# EAGLE design YOTSUBA_AP_EM_ver.4.0 (EAGLE 9.6.2)
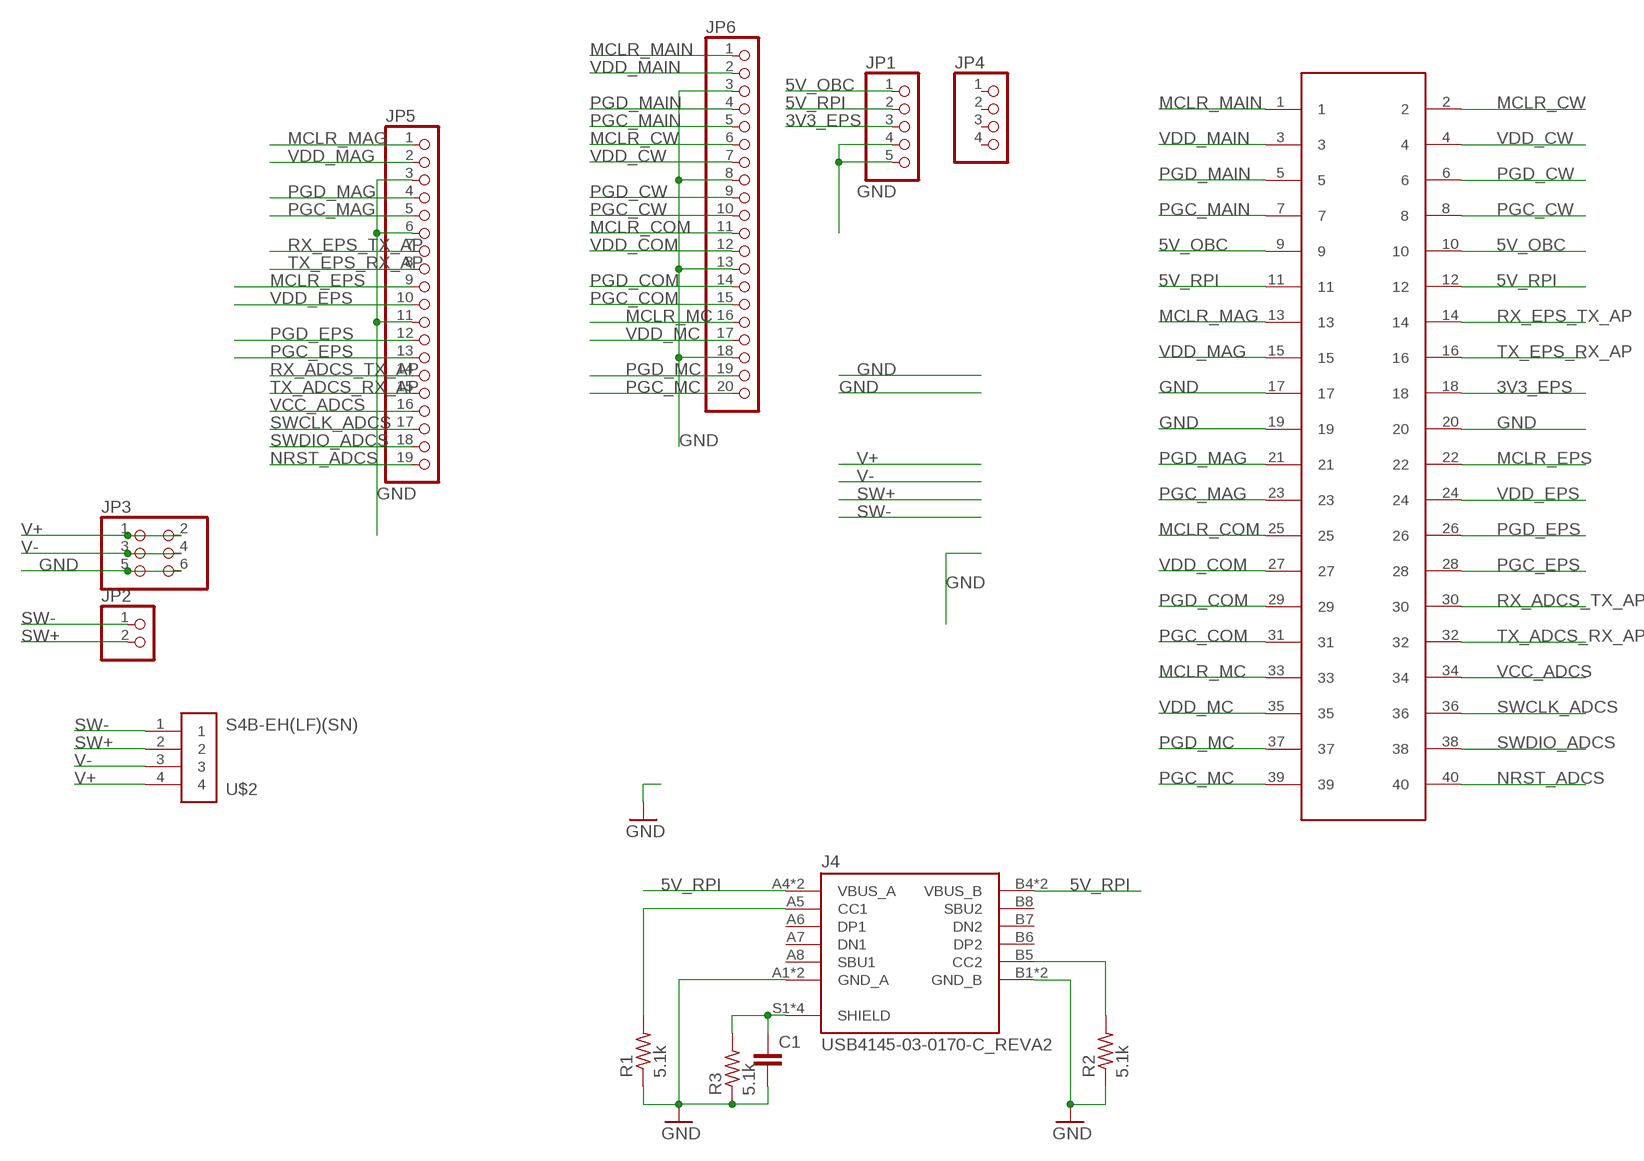
[diagram p0: schematic, sheet 1]

## Parts
C1  C-EUC2012  [C2012]
J4  USB4145-03-0170-C_REVA2  [GCT_USB4145-03-0170-C_REVA2]
JP1  PINHD-1X5  [1X05]
JP2  PINHD-1X2  [1X02]
JP3  PINHD-2X3  [2X03]
JP4  PINHD-1X4  [1X04]
JP5  PINHD-1X19  [1X19]
JP6  PINHD-1X20  [1X20]
R1  5.1k  R-US_R0805  [R0805]
R2  5.1k  R-US_R0805  [R0805]
R3  5.1k  R-US_R0805  [R0805]
U$1  M50-3902042  [M50-3902042]
U$2  S4B-EH(LF)(SN)  [JST_S4B-EH(LF)(SN)]

## Nets
3V3_EPS: JP1.3 U$1.18
5V_OBC: JP1.1 U$1.9 U$1.10
5V_RPI: J4.A4(VBUS_A) J4.A9(VBUS_A) J4.B4(VBUS_B) J4.B9(VBUS_B) JP1.2 U$1.11 U$1.12
GND [gnd]: C1.2 J4.A1(GND_A) J4.A12(GND_A) J4.B1(GND_B) J4.B12(GND_B) JP1.4 JP1.5 JP3.5 JP3.6 JP5.3 JP5.6 JP5.11 JP6.3 JP6.8 JP6.13 JP6.18 R1.1 R2.1 R3.1 U$1.17 U$1.19 U$1.20
MCLR_COM: JP6.11 U$1.25
MCLR_CW: JP6.6 U$1.2
MCLR_EPS: JP5.9 U$1.22
MCLR_MAG: JP5.1 U$1.13
MCLR_MAIN: JP6.1 U$1.1
MCLR_MC: JP6.16 U$1.33
N$1: C1.1 J4.S1(SHIELD) J4.S2(SHIELD) J4.S3(SHIELD) J4.S4(SHIELD) R3.2
N$2: J4.A5(CC1) R1.2
N$3: J4.B5(CC2) R2.2
NRST_ADCS [gnd]: JP5.19 U$1.40
PGC_COM: JP6.15 U$1.31
PGC_CW: JP6.10 U$1.8
PGC_EPS: JP5.13 U$1.28
PGC_MAG: JP5.5 U$1.23
PGC_MAIN: JP6.5 U$1.7
PGC_MC: JP6.20 U$1.39
PGD_COM: JP6.14 U$1.29
PGD_CW: JP6.9 U$1.6
PGD_EPS: JP5.12 U$1.26
PGD_MAG: JP5.4 U$1.21
PGD_MAIN: JP6.4 U$1.5
PGD_MC: JP6.19 U$1.37
RX_ADCS_TX_AP: JP5.14 U$1.30
RX_EPS_TX_AP: JP5.7 U$1.14
SW+ [pwr]: JP2.2 U$2.2
SW- [pwr]: JP2.1 U$2.1
SWCLK_ADCS: JP5.17 U$1.36
SWDIO_ADCS: JP5.18 U$1.38
TX_ADCS_RX_AP: JP5.15 U$1.32
TX_EPS_RX_AP: JP5.8 U$1.16
V+ [pwr]: JP3.1 JP3.2 U$2.4
V- [pwr]: JP3.3 JP3.4 U$2.3
VCC_ADCS: JP5.16 U$1.34
VDD_COM: JP6.12 U$1.27
VDD_CW: JP6.7 U$1.4
VDD_EPS: JP5.10 U$1.24
VDD_MAG: JP5.2 U$1.15
VDD_MAIN: JP6.2 U$1.3
VDD_MC: JP6.17 U$1.35
Unconnected: J4.A6(DP1) J4.A7(DN1) J4.A8(SBU1) J4.B6(DP2) J4.B7(DN2) J4.B8(SBU2) JP4.1 JP4.2 JP4.3 JP4.4

## Library data of the parts
C1 = rcl:C-EU: CAPACITOR, European symbol; SPICEPREFIX: C
J4 = USB4145-03-0170-C_REVA2:USB4145-03-0170-C_REVA2: Check availability <https://pricing.snapeda.com/parts/USB4145-03-0170-C/Global%20Connector%20Technology/view-part?ref=eda>; AVAILABILITY: In Stock; DESCRIPTION: Type C USB 2.0 Connector; MF: Global Connector Technology; MP: USB4145-03-0170-C; PACKAGE: None; PRICE: None
JP1 = pinhead:PINHD-1X5: PIN HEADER
JP2 = pinhead:PINHD-1X2: PIN HEADER
JP3 = pinhead:PINHD-2X3: PIN HEADER
JP4 = pinhead:PINHD-1X4: PIN HEADER
JP5 = pinhead:PINHD-1X19: PIN HEADER
JP6 = pinhead:PINHD-1X20: PIN HEADER
R1-R3 = rcl:R-US_: RESISTOR, American symbol; SPICEPREFIX: R
U$1 = MITSUBA_Connectors-v4.0:M50-3902042: 40pins 1.27mm pitch 2line pinheader
U$2 = S4B-EH_LF__SN_:S4B-EH(LF)(SN): EH Series 4 Position 2.5 mm Side Entry Single Row Shrouded Header Check availability <https://pricing.snapeda.com/parts/S4B-EH%28LF%29%28SN%29/JST%20Sales/view-part?ref=eda>; AVAILABILITY: In Stock; DESCRIPTION: Connector Header Through Hole, Right Angle 4 position 0.098 (2.50mm); MF: JST Sales; MP: S4B-EH(LF)(SN); PACKAGE: None; PRICE: None; PURCHASE-URL: https://pricing.snapeda.com/search/part/S4B-EH(LF)(SN)/?ref=eda

## Net classes
0 default: clearance 0.254 mm
1 gnd: clearance 0.559 mm
2 pwr: clearance 0.229 mm
3 gnd_usb: clearance 0.025 mm

## Board
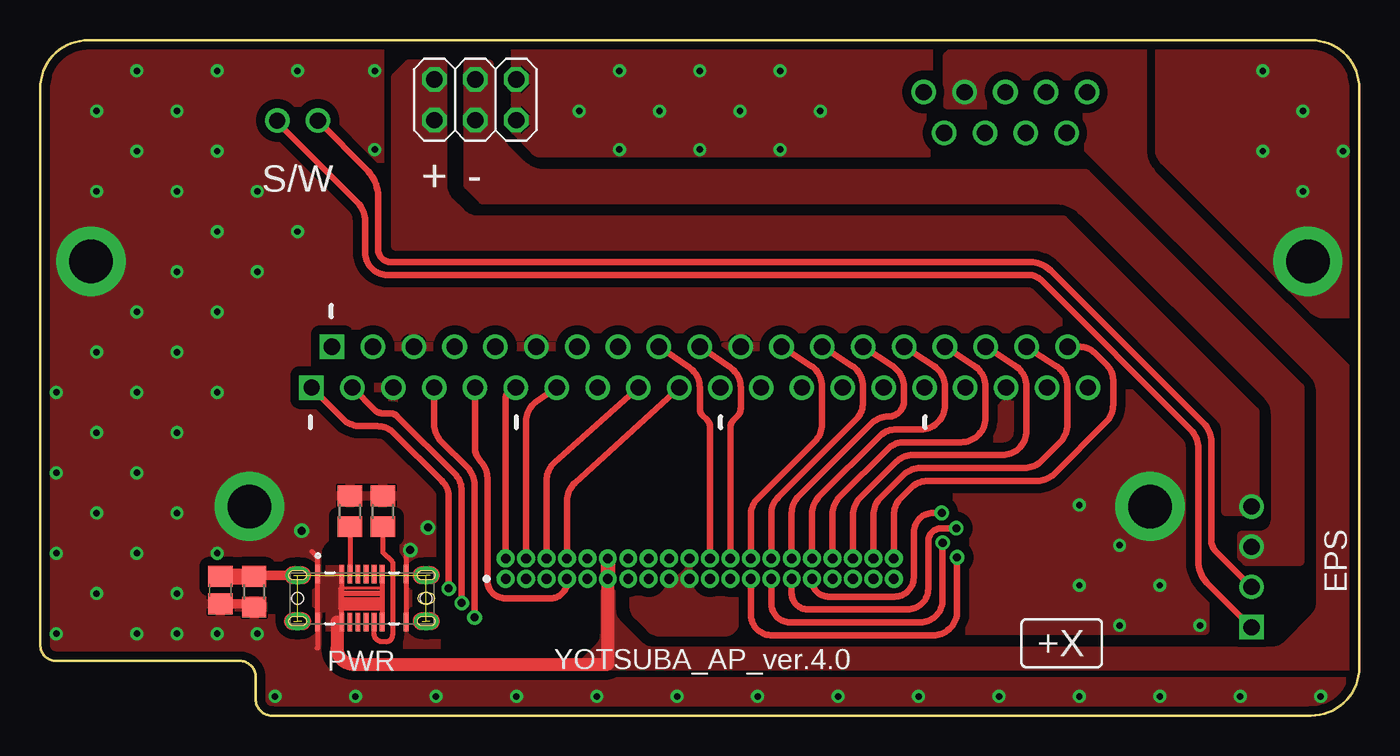
[diagram p1: board, top side]
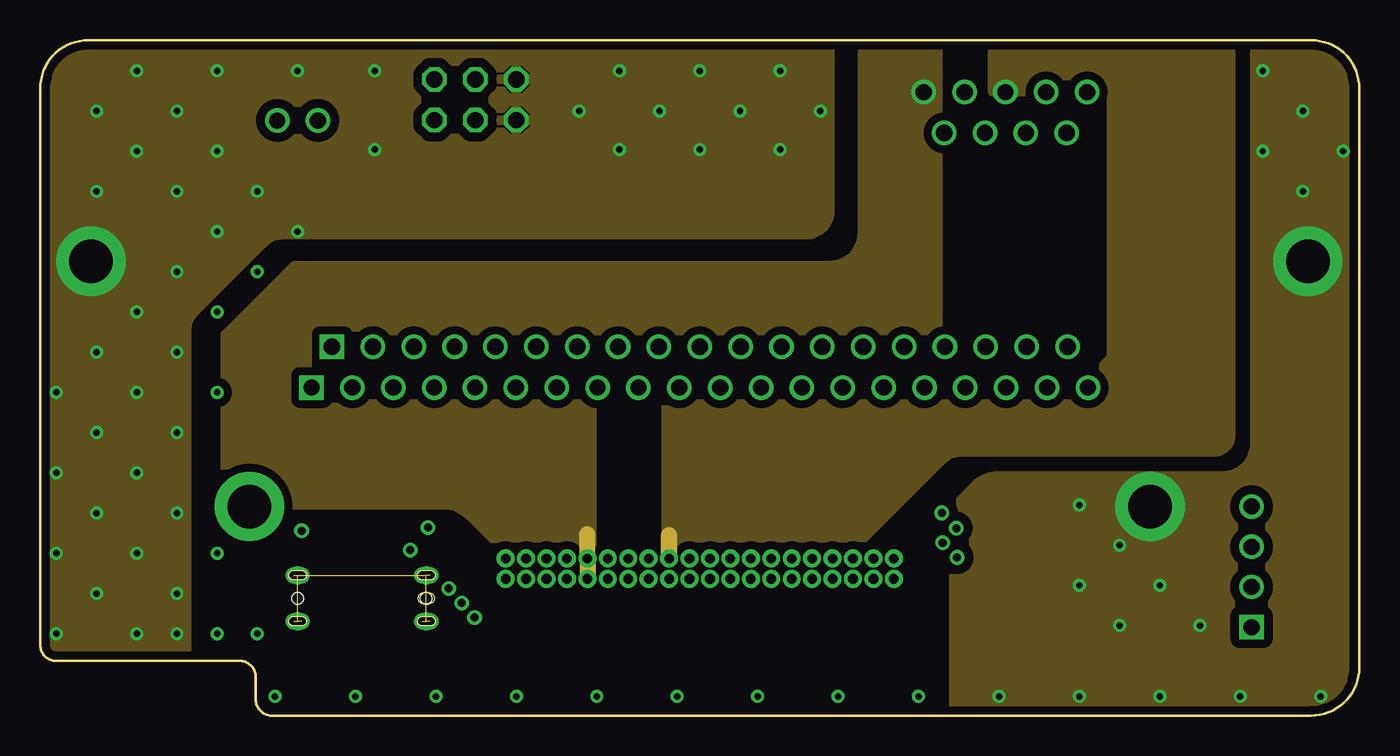
[diagram p2: board, inner layer Route2]
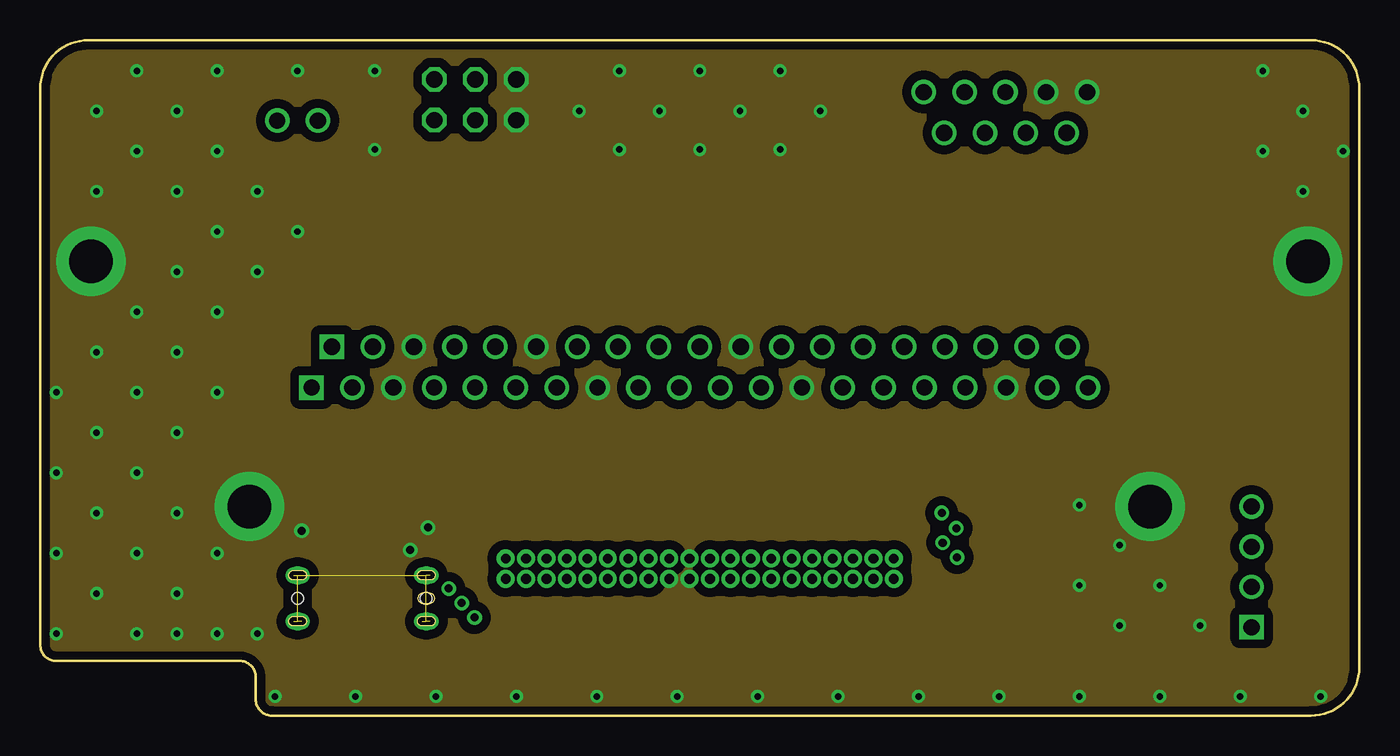
[diagram p3: board, inner layer Route15]
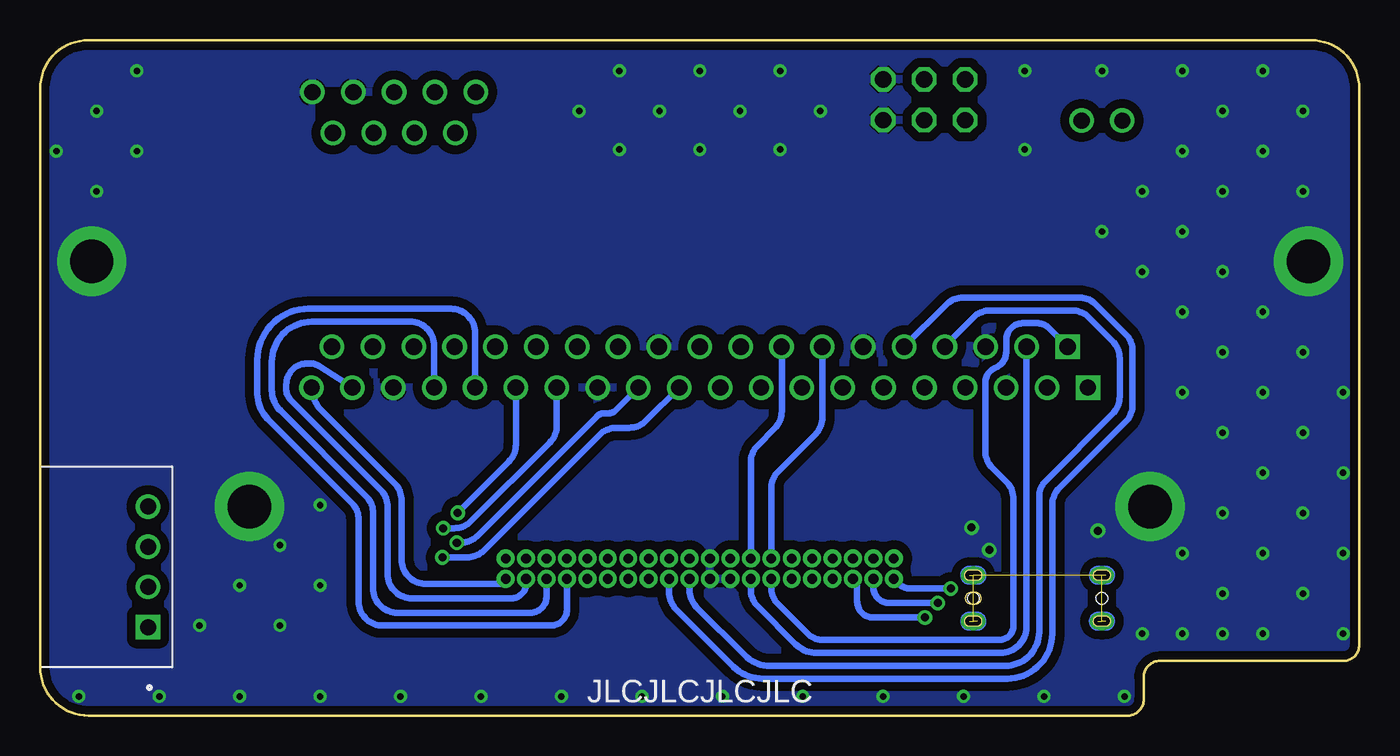
[diagram p4: board, bottom side, seen from below]

Size 82 x 42 mm. Coordinates in mm from the lower left corner, seen from the top.
Outline: 14.4,0 79,0 arc90 82,3 82,39 arc90 79,42 3,42 arc90 0,39 0,4.4 arc90 1,3.4 12.4,3.4 arc-90 13.4,2.4 13.4,1 arc90 14.4,0
Copper layers (1+2*15+16): Top 0.035mm / dielectric 1.5mm / Route2 0.035mm / dielectric 0.15mm / Route15 0.035mm / dielectric 0.2mm / Bottom 0.035mm
Design rules "default *": minimum track width 6mil, minimum drill 0.35mm, track to track 6mil, track to pad 6mil, pad to pad 6mil, via to via 6mil, smd to smd 6mil, copper to edge 20mil, drill to drill 6mil, minimum pad ring 10mil, minimum via ring 8mil, stop-mask expansion 4mil, vias tented up to drill 30mil, thermal gap 4mil
tRestrict: 6 lines
bRestrict: 10 lines

### Footprints (pad centres in the part's own frame; a part is rotated, then mirrored left to right if it is on the bottom)
C2012 = smd 1.3 x 1.5: 1 -0.85,0; 2 0.85,0
GCT_USB4145-03-0170-C_REVA2 = smd 0.3 x 1.15: A1 -2.75,1.485; A4 -1.25,1.485; A5 -0.75,1.485; A6 -0.25,1.485; A7 0.25,1.485; A8 0.75,1.485; A9 1.25,1.485; A12 2.75,1.485; B1 2.75,-1.485; B4 1.25,-1.485; B5 0.75,-1.485; B6 0.25,-1.485; B7 -0.25,-1.485; B8 -0.75,-1.485; B9 -1.25,-1.485; B12 -2.75,-1.485 | drill 0.6 pad 1.1: S1 -4,1.43; S2 4,1.43; S3 -4,-1.43; S4 4,-1.43 | hole 0.71: -4,0; 4,0
1X05 = drill 1.016: 1 -5.08,0; 2 -2.54,0; 3 0,0; 4 2.54,0; 5 5.08,0
1X02 = drill 1.016: 1 -1.27,0; 2 1.27,0
2X03 = drill 1.016 octagon: 1 -2.54,-1.27; 2 -2.54,1.27; 3 0,-1.27; 4 0,1.27; 5 2.54,-1.27; 6 2.54,1.27
1X04 = drill 1.016: 1 -3.81,0; 2 -1.27,0; 3 1.27,0; 4 3.81,0
1X19 = drill 1.016 square: 1 -22.86,0 | drill 1.016: 2 -20.32,0; 3 -17.78,0; 4 -15.24,0; 5 -12.7,0; 6 -10.16,0; 7 -7.62,0; 8 -5.08,0; 9 -2.54,0; 10 0,0; 11 2.54,0; 12 5.08,0; 13 7.62,0; 14 10.16,0; 15 12.7,0; 16 15.24,0; 17 17.78,0; 18 20.32,0; 19 22.86,0
1X20 = drill 1.016 square: 1 -24.13,0 | drill 1.016: 2 -21.59,0; 3 -19.05,0; 4 -16.51,0; 5 -13.97,0; 6 -11.43,0; 7 -8.89,0; 8 -6.35,0; 9 -3.81,0; 10 -1.27,0; 11 1.27,0; 12 3.81,0; 13 6.35,0; 14 8.89,0; 15 11.43,0; 16 13.97,0; 17 16.51,0; 18 19.05,0; 19 21.59,0; 20 24.13,0
R0805 = smd 1.3 x 1.5: 1 -0.95,0; 2 0.95,0
M50-3902042 = drill 0.6: 1 0,0; 2 0,1.27; 3 1.27,0; 4 1.27,1.27; 5 2.54,0; 6 2.54,1.27; 7 3.81,0; 8 3.81,1.27; 9 5.08,0; 10 5.08,1.27; 11 6.35,0; 12 6.35,1.27; 13 7.62,0; 14 7.62,1.27; 15 8.89,0; 16 8.89,1.27; 17 10.16,0; 18 10.16,1.27; 19 11.43,0; 20 11.43,1.27; 21 12.7,0; 22 12.7,1.27; 23 13.97,0; 24 13.97,1.27; 25 15.24,0; 26 15.24,1.27; 27 16.51,0; 28 16.51,1.27; 29 17.78,0; 30 17.78,1.27; 31 19.05,0; 32 19.05,1.27; 33 20.32,0; 34 20.32,1.27; 35 21.59,0; 36 21.59,1.27; 37 22.86,0; 38 22.86,1.27; 39 24.13,0; 40 24.13,1.27
JST_S4B-EH(LF)(SN) = drill 1 pad 1.5 square: 1 0,0 | drill 1 pad 1.5: 2 2.5,0; 3 5,0; 4 7.5,0

### Placement (x,y rotation side)
C1  11.2,7.8 270 top
J4  20,7.3 0 top
JP1  60,38.77 0 top
JP2  16,37 0 top
JP3  27.05,38.3 0 top
JP4  60,36.23 0 top
JP5  41,22.94 0 top
JP6  41,20.4 0 top
R1  19.25,12.7 270 top
R2  21.3,12.7 270 top
R3  13.3,7.7 90 top
U$1  28.93,8.5 0 top
U$2  75.3,5.5 90 bottom

### Tracks (layer width: path | path; a pad name or v marks a point on that pad's centre or on a via)
3V3_EPS
  Route2 1.016: U$1.18 39.09,11.2 39.1,11.2
  pour Route2 (isolate 0.5, no thermals): 38.9,19.4 38.9,9 49.2,9 56.16,15.96 arc-45 57.22,16.4 73,16.4 arc90 74,17.4 74,45.1 59.2,45.1 59.2,38.8 66.6,38.8 66.6,22.3 64.8,20.5 40,20.5
5V_OBC
  Route2 1: 34,11.3 34.02,11.29 U$1.10 U$1.9
  pour Route2 (isolate 0.5, no thermals): 34.3,9.7 34.3,20.4 30.8,20.4 30.8,22.8 55.8,22.8 55.8,43.3 51.1,43.3 51.1,30 arc-90 49.1,28 15.8,28 11.5,23.7 11.5,15.3 13.7,13.1 25.17,13.1 arc-45 26.59,12.51 29.1,10 32.4,10 32.7,9.7
5V_RPI
  Top 0.2: J4.A4 18.4,8.79 | 21.25,7.9 18.75,7.9 18.6,7.9 18.6,6.64 18.75,6.64 | 18.75,7.7 21.25,7.7 | 21.25,7.3 18.75,7.3 18.75,7.5 21.25,7.5 | 18.75,7.1 21.25,7.1 21.25,7 | 21.25,6.9 18.75,6.9 18.75,6.8 21.25,6.8 21.25,6.7 | 21.25,6.6 21.25,6.64 18.75,6.64
  Top 0.203: J4.B9 18.45,5.82
  Top 0.3: J4.B4 21.25,6.9 21.25,7 21.25,7.3 21.25,7.5 21.25,7.7 21.25,7.9 J4.A9 | J4.B9 18.75,6.64 18.75,6.8 18.75,7.1 18.75,7.5 18.75,7.7 18.75,7.9 J4.A4
  Top 0.8: 18.45,5.82 18.45,4.2 arc90 19.45,3.2 35.28,3.2 U$1.11
  Top 0.9: U$1.12 U$1.11
  pour Top (no thermals): 17.75,9.35 17.75,5.25 18.9,5.25 18.9,9.35
  pour Top (isolate 0.5, no thermals): 56.4,41 56.4,38 62.4,38 79.14,21.26 arc-45 79.6,20.14 79.6,6.91 arc-45 79.31,6.21 77.39,4.29 arc-45 76.69,4 38.01,4 arc-45 37.31,4.29 35.79,5.81 arc-45 35.5,6.51 35.5,9.6 35.1,9.6 35.1,5.01 arc-45 34.81,4.31 33.6,3.1 85.5,3.1 85.5,17.3 69.09,33.71 arc-45 68.5,35.13 68.5,42.7 58.1,42.7
GND  (via drill 0.4, 0.5, 2.7 pad 4.3)
  Top 0.3: J4.B1 J4.A12 22.75,10.55 v23,10.3 | 16.9,10.2 17.25,9.85 J4.A1 J4.B12 17.25,4.2 17.2,4.2
  Top 0.6: C1.2 13.3,6.95
  Top 0.8: 13.3,6.95 R3.1
  other vias: 8.5,17.6 3.5,17.6 6,20.1 1,20.1 3.5,22.6 11,25.1 8.5,27.6 11,30.1 36,40.1 36,35.2 38.5,37.6 41,35.2 78.5,37.6 81,35.1 76,35.1 78.5,32.6 8.5,12.6 3.5,12.6 6,15.1 3.5,7.6 1,10.1 1,5.1 8.5,7.6 1,15.1 14.6,1.2 29.6,1.2 34.6,1.2 41,40.1 76,40.1 16.25,11.5 6,10.1 11,10.1 3.15,28.25 78.8,28.25 13,13 69,13 8.5,32.6 6,35.1 8.5,37.6 6,40.1 3.5,37.6 11,35.1 13.5,32.6 13.5,27.6 16,30.1 8.5,22.6 6,25.1 11,20.1 3.5,32.6 11,40.1 16,40.1 20.8,40.1 20.8,35.2 43.5,37.6 46,40.1 48.5,37.6 46,35.2 33.5,37.6 72.1,5.6 67.1,5.6 69.6,8.1 64.6,8.1 64.6,13.1 67.1,10.6 39.6,1.2 44.6,1.2 49.6,1.2 54.6,1.2 59.6,1.2 64.6,1.2 69.6,1.2 74.6,1.2 79.6,1.2 24.6,1.2 19.6,1.2 6,5.1 11,5.1 13.5,5.1 8.5,5.1 24.1,11.7
  pour Bottom (isolate 0.5): -3.31,-4.02 -3.31,39.31 arc-90 -0.01,42.61 80.13,42.61 arc-90 82.53,40.21 82.53,-4.02
  pour Top: 21.1,45.4 21.1,27.1 63.3,27.1 64.3,26.1 64.3,22.9 20.7,22.9 20.7,20.8 24.6,16.9 24.6,2.1 85,2.1 85,-3.5 -5.3,-3.5 -5.3,45.4
  pour Top (no thermals): 36.9,9.4 42.2,9.4 arc-90 43.2,8.4 43.2,5.9 arc-90 42.5,5.2 38.61,5.2 arc-45 37.91,5.49 37.19,6.21 arc-45 36.9,6.91
  pour Top: 68.4,21.1 72.4,17.4 72.4,5.3 57.4,5.3 55.4,14.3 60.9,20.4
  pour Top: 29.54,42.8 29.54,36.36 30.73,35.17 arc45 31.14,35 55.2,35 55.2,42.8
  pour Top: 69.6,42.6 69.6,35.21 arc45 69.89,34.51 79.11,25.29 arc45 79.81,25 86.1,25 86.1,41.6 83.2,44.5 71.5,44.5
  pour Route15 (no thermals): -1.5,46.1 85.5,46.1 arc-90 86.5,45.1 86.5,-3.8 arc-90 85.5,-4.8 -1.5,-4.8 arc-90 -2.5,-3.8 -2.5,45.1 arc-90
  pour Route2: -0.4,0 9.1,0 9.1,23.98 arc-45 9.54,25.04 13.96,29.46 arc-45 15.02,29.9 47.6,29.9 arc90 49.1,31.4 49.1,42.9 arc90 48.4,43.6 -1.4,43.6 arc90 -2.9,42.1 -2.9,2.5 arc90
  pour Route2: 75.5,43.1 75.5,16.9 arc-90 73.5,14.9 59.53,14.9 arc45 58.11,14.31 56.79,12.99 56.79,-1.6 82.8,-1.6 85.8,1.4 85.8,41.6 84.3,43.1
MCLR_COM  (via drill 0.5)
  Top 0.4: U$1.25 44.17,6.35 arc90 45.39,5 55.5,5 arc90 57,6.5 v57,9.84
  Bottom 0.4: v57,9.84 55.47,9.84 arc-45 54.41,10.28 47.23,17.46 arc45 46.17,17.9 45.39,17.9 arc-45 44.33,18.34 JP6.11
MCLR_CW
  Top 0.4: U$1.2 28.93,19.73 arc-87 JP6.6
MCLR_EPS
  Top 0.4: U$1.22 41.63,17.95 arc45 41.45,18.4 41.19,18.66 arc-45 41,19.11 41,20.41 arc56 40.35,21.65 JP5.9
MCLR_MAG
  Bottom 0.4: U$1.13 36.55,7.98 arc-45 36.12,6.92 34.34,5.14 arc-45 33.28,4.7 22.4,4.7 arc-90 21.5,5.6 21.5,13.48 arc-45 21.94,14.54 22.81,15.41 arc45 23.25,16.47 23.25,20.7 arc62 22.72,21.58 22.48,21.72 arc-62 21.95,22.6 21.95,23.35 arc90 20.95,24.4 19.96,24.4 arc45 19.26,24.06 JP5.1
MCLR_MAIN  (via drill 0.5)
  Top 0.4: v25.4,7.9 25.4,13.55 arc45 24.96,14.61 22.01,17.56 arc45 20.95,18 19.89,18 arc-45 18.83,18.44 JP6.1
  Bottom 0.4: U$1.1 28.63,8.19 arc-45 27.92,7.9 v25.4,7.9
MCLR_MC
  Bottom 0.4: JP6.16 54.97,23.8 arc-90 56.47,25.3 65.3,25.3 arc-90 68.5,22.1 68.5,20 arc-45 67.86,18.46 62.64,13.24 arc45 62.2,12.18 62.2,7.1 arc-90 60.7,5.6 50.26,5.6 arc-90 49.26,6.6 U$1.33
N$1  (via drill 0.6 pad 1)  (11 unrouted)
  Top 0.6: J4.S1 13.38,8.73 R3.2
  Top 1: C1.1 R3.2
  other vias: 23.75,8.73 24.25,8.73 23.75,5.87 24.25,5.87 15.75,8.73 16.25,8.73 16.25,5.87 15.75,5.87
N$2
  Top 0.3: 18.77,11.27 R1.2 J4.A5
N$3
  Top 0.3: J4.B5 20.75,5.1 arc90 21.25,4.6 21.5,4.6 arc90 21.9,5 21.9,9.55 21.3,10.15 R2.2
NRST_ADCS
  Top 0.4: U$1.40 53.06,12.48 arc-45 53.5,13.54 54.13,14.16 arc-45 55.19,14.6 61.98,14.6 arc45 63.04,15.04 66.26,18.26 arc45 66.7,19.32 66.7,20.87 arc45 66.33,21.77 65.53,22.57 arc45 64.63,22.94 JP5.19
PGC_COM  (via drill 0.5)
  Top 0.4: U$1.31 47.98,8.4 arc90 48.98,7.4 53.11,7.4 arc90 54.3,8.59 54.31,11.41 arc-90 55.52,12.61 v56.05,12.61
  Bottom 0.4: v56.05,12.61 52.87,15.79 arc-45 52.43,16.85 JP6.15
PGC_CW
  Top 0.4: U$1.8 32.74,13.35 arc-48 33.23,14.46 JP6.10
PGC_EPS
  Top 0.4: JP5.13 50.47,21.74 arc-57 51.15,20.48 51.15,19.47 arc-45 50.71,18.41 45.88,13.58 arc45 45.45,12.52 U$1.28
PGC_MAG
  Bottom 0.4: U$1.23 42.91,7.68 arc-45 42.47,6.62 38.89,3.04 arc-45 37.1,2.3 21.89,2.3 arc-90 19.09,5.1 19.09,13.09 arc45 18.65,14.15 14.54,18.26 arc-45 14.1,19.32 14.1,22.68 arc-45 14.54,23.74 16.36,25.56 arc-45 17.42,26 24.62,26 arc-45 25.68,25.56 JP5.5
PGC_MAIN
  Top 0.4: U$1.7 32.74,8.3 arc-90 31.75,7.3 28.9,7.3 arc-90 27.8,8.4 27.8,14.78 arc44 27.38,15.82 arc-44 27.03,16.68 JP6.5
PGC_MC
  Bottom 0.4: U$1.39 53.37,8.2 58.03,8.2 arc90 59.53,9.7 59.53,13.38 arc-45 59.97,14.44 64.59,19.06 arc45 65.03,20.12 65.03,20.3 JP6.20
PGD_COM  (via drill 0.5)
  Top 0.4: U$1.29 46.72,7.66 arc90 47.7,6.6 53.91,6.6 arc90 55.2,7.89 55.22,10.85 arc-90 56.01,11.65 v56.95,11.65
  Bottom 0.4: v56.95,11.65 56.43,11.65 56.43,11.66 56.26,11.66 arc-45 55.2,12.1 50.33,16.97 arc-45 49.89,18.03 JP6.14
PGD_CW
  Top 0.4: U$1.6 31.48,14.61 arc-48 31.98,15.73 JP6.9
PGD_EPS
  Top 0.4: JP5.12 47.92,21.74 arc-57 48.6,20.49 48.6,18.12 arc-45 48.16,17.06 44.61,13.51 arc45 44.17,12.45 U$1.26
PGD_MAG
  Bottom 0.4: U$1.21 41.63,7.81 arc-45 41.2,6.75 38.19,3.74 arc-45 36.65,3.1 22,3.1 arc-90 19.9,5.2 19.9,13.58 arc45 19.46,14.64 15.34,18.76 arc-45 14.9,19.82 14.9,22.23 arc-45 15.34,23.29 16.81,24.76 arc-45 17.87,25.2 22.93,25.2 arc-45 23.99,24.76 25.76,22.99 JP5.4
PGD_MAIN  (via drill 0.5)
  Top 0.4: v27,6.1 27,14.37 arc45 26.56,15.43 24.93,17.06 arc-45 24.49,18.12 JP6.4
  Bottom 0.4: v27,6.1 30.21,6.1 arc90 31.21,7.1 31.21,8.24 U$1.5
PGD_MC
  Bottom 0.4: U$1.37 51.8,8.2 arc90 52.7,7.3 58.9,7.3 arc90 60.4,8.8 60.4,12.98 arc-45 60.84,14.04 66.41,19.61 arc45 66.7,20.31 66.7,20.6 arc90 65.4,21.9 65.2,21.9 arc33 64.65,21.74 JP6.19
RX_ADCS_TX_AP
  Top 0.4: U$1.30 46.72,12.59 arc-45 47.15,13.65 51.66,18.16 arc-45 52.72,18.6 arc90 53.7,19.57 53.7,20.45 arc56 53.03,21.7 JP5.14
  Route15 0.5: U$1.30 46.74,9.8
RX_EPS_TX_AP
  Top 0.4: U$1.14
  Bottom 0.4: JP5.7 33.38,18.54 arc45 33.82,17.48 36.12,15.18 arc-45 36.55,14.12 U$1.14
SW+
  Top 0.4: U$2.2 73.09,10.21 arc-45 72.8,10.91 72.8,17.04 arc45 72.34,18.16 62.83,27.67 arc45 61.54,28.2 21.8,28.2 arc-90 21,29 21,32.3 arc44 20.37,33.84 JP2.2
SW-
  Top 0.4: JP2.1 14.73,36.9 19.74,31.89 arc-45 20.2,30.77 20.2,28.8 arc90 21.6,27.4 61.44,27.4 arc-45 62.22,27.08 71.54,17.76 arc-45 72,16.64 72,9.56 arc45 72.53,8.27 U$2.1
SWCLK_ADCS
  Top 0.4: U$1.36 50.52,12.48 arc-45 50.96,13.54 53.19,15.76 arc-45 54.25,16.2 59.8,16.2 arc90 61.3,17.7 61.3,20.49 arc57 60.62,21.74 JP5.17
SWDIO_ADCS
  Top 0.4: U$1.38 51.8,12.48 arc-45 52.23,13.54 53.66,14.96 arc-45 54.72,15.4 61.18,15.4 arc45 62.24,15.84 63.41,17.01 arc45 63.85,18.07 63.85,20.48 arc58 63.15,21.75 61.4,22.86 JP5.18
TX_ADCS_RX_AP
  Top 0.4: U$1.32 47.98,12.56 arc-45 48.42,13.62 52.16,17.36 arc-45 53.22,17.8 54.74,17.8 arc90 56.24,19.3 56.24,20.47 arc57 55.56,21.73 JP5.15
  Route15 0.5: U$1.32 47.97,9.78
TX_EPS_RX_AP
  Bottom 0.4: U$1.16 37.83,15.75 arc45 37.39,16.81 36.34,17.86 arc-45 35.9,18.92 35.9,22.92 JP5.8
V+
  pour Top (no thermals): 22.9,40.5 25,40.5 25,33.06 arc45 25.46,31.94 26.14,31.26 arc45 27.26,30.8 63.6,30.8 75.5,18.9 75.5,12.7 73.7,12.7 73.7,17.79 arc45 73.41,18.49 63.41,28.49 arc45 61.7,29.2 22.1,29.2 22.1,39.7
V-
  pour Top (no thermals): 26.6,40.5 27.9,40.5 27.9,36.3 29.94,34.26 arc45 31.3,33.7 65,33.7 78.3,20.4 78.3,9.6 74.97,9.6 74.7,9.87 74.7,11.2 75.8,11.2 arc90 76.8,12.2 76.8,18.74 arc45 76.34,19.86 64.88,31.32 arc45 63,32.1 27.5,32.1 26.6,33
VCC_ADCS
  Top 0.4: U$1.34 49.26,12.53 arc-45 49.69,13.59 52.66,16.56 arc-45 53.72,17 57.25,17 arc90 58.75,18.5 58.75,20.49 arc57 58.07,21.74 JP5.16
VDD_COM  (via drill 0.5)
  Top 0.4: U$1.27 45.45,7 arc90 46.6,5.8 54.7,5.8 arc90 56.1,7.2 v56.1,10.75
  Bottom 0.4: v56.1,10.75 55.87,10.75 arc-45 54.81,11.19 47.39,18.61 arc45 46.94,18.8 46.67,18.8 arc-45 46.22,18.99 JP6.12
VDD_CW
  Top 0.4: U$1.4 30.2,18.3 arc-56 30.86,19.54 JP6.7
VDD_EPS
  Top 0.4: U$1.24 42.91,17.94 arc-45 43.09,18.39 43.36,18.66 arc45 43.55,19.11 43.55,20.41 arc56 42.9,21.65 JP5.10
VDD_MAG
  Route2 0.5: U$1.15 37.83,8.2
  Bottom 0.4: U$1.15 37.83,7.85 arc-45 37.39,6.79 35.04,4.44 arc-45 33.74,3.9 22.3,3.9 arc-90 20.7,5.5 JP5.2
VDD_MAIN  (via drill 0.5)
  Top 0.4: v26.2,7 26.2,13.99 arc45 25.76,15.05 22.2,18.61 arc45 21.75,18.8 21.27,18.8 arc-45 20.82,18.99 JP6.2
  Bottom 0.4: U$1.3 30.2,8 arc-90 29.2,7 v26.2,7
VDD_MC
  Bottom 0.4: U$1.35 50.52,7.4 arc90 51.52,6.4 59.8,6.4 arc90 61.3,7.9 61.3,12.58 arc-45 61.74,13.64 67.06,18.96 arc45 67.6,20.26 67.6,22 arc90 65.1,24.5 59.01,24.5 arc90 57.51,23 JP6.17

### Text on the board
tNames: + | - | S/W | EPS | YOTSUBA_AP_ver.4.0 | +X | PWR
bNames: JLCJLCJLCJLC